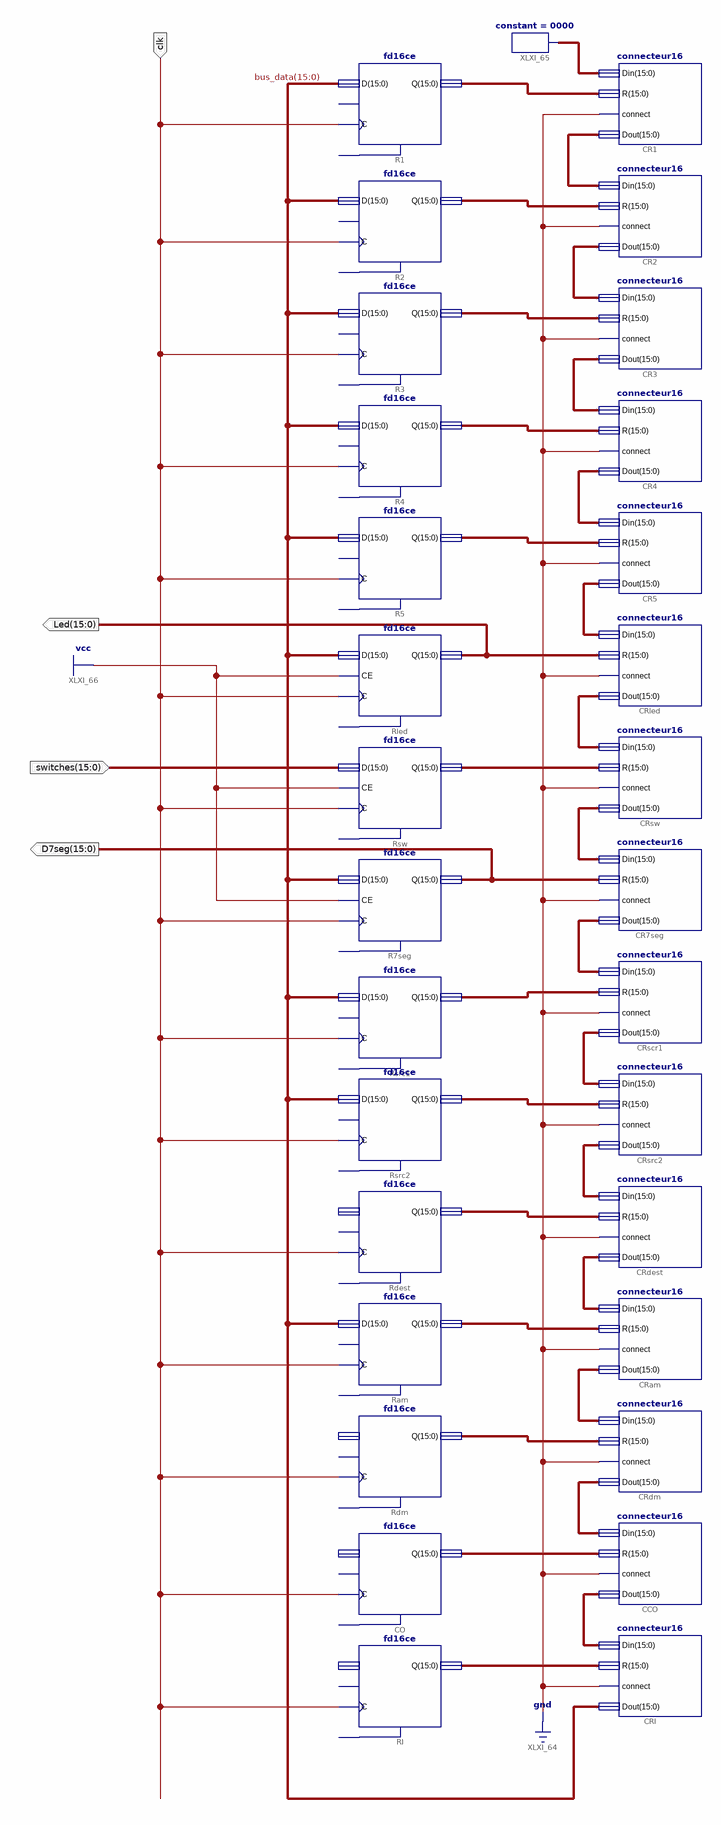
[diagram p0: schematic sheet 1]
// Xilinx ISE schematic S3.sch (spartan3e) as structural Verilog: 31 symbols, 4 ports
module S3 (
  input  clk,
  input  [15:0] switches,
  output [15:0] Led,
  output [15:0] D7seg
);

  wire [15:0] bus_data, XLXN_3, XLXN_4, XLXN_5, XLXN_6, XLXN_7, XLXN_9, XLXN_11, XLXN_12, XLXN_13, XLXN_14,
       XLXN_15, XLXN_16, XLXN_17, XLXN_18, XLXN_22, XLXN_24, XLXN_26, XLXN_28, XLXN_30, XLXN_32, XLXN_34,
       XLXN_36, XLXN_38, XLXN_40, XLXN_42, XLXN_44, XLXN_46, XLXN_55;

  fd16ce R7seg (.C(clk), .CE(1'b1), .D(bus_data), .Q(D7seg));  // open: CLR
  fd16ce Rsw (.C(clk), .CE(1'b1), .D(switches), .Q(XLXN_9));  // open: CLR
  fd16ce Rled (.C(clk), .CE(1'b1), .D(bus_data), .Q(Led));  // open: CLR
  fd16ce R5 (.C(clk), .D(bus_data), .Q(XLXN_7));  // open: CE, CLR
  fd16ce R4 (.C(clk), .D(bus_data), .Q(XLXN_6));  // open: CE, CLR
  fd16ce R3 (.C(clk), .D(bus_data), .Q(XLXN_5));  // open: CE, CLR
  fd16ce Rsrc1 (.C(clk), .D(bus_data), .Q(XLXN_11));  // open: CE, CLR
  fd16ce Rdest (.C(clk), .Q(XLXN_13));  // open: CE, CLR, D
  fd16ce Rdm (.C(clk), .Q(XLXN_15));  // open: CE, CLR, D
  fd16ce CO (.C(clk), .Q(XLXN_16));  // open: CE, CLR, D
  fd16ce Rsrc2 (.C(clk), .D(bus_data), .Q(XLXN_12));  // open: CE, CLR
  fd16ce Ram (.C(clk), .D(bus_data), .Q(XLXN_14));  // open: CE, CLR
  fd16ce RI (.C(clk), .Q(XLXN_17));  // open: CE, CLR, D
  fd16ce R2 (.C(clk), .D(bus_data), .Q(XLXN_4));  // open: CE, CLR
  fd16ce R1 (.C(clk), .D(bus_data), .Q(XLXN_3));  // open: CE, CLR
  connecteur16 CR1 (.Din(XLXN_55), .R(XLXN_3), .connect(1'b0), .Dout(XLXN_18));
  connecteur16 CR2 (.Din(XLXN_18), .R(XLXN_4), .connect(1'b0), .Dout(XLXN_22));
  connecteur16 CR3 (.Din(XLXN_22), .R(XLXN_5), .connect(1'b0), .Dout(XLXN_24));
  connecteur16 CR4 (.Din(XLXN_24), .R(XLXN_6), .connect(1'b0), .Dout(XLXN_26));
  connecteur16 CR5 (.Din(XLXN_26), .R(XLXN_7), .connect(1'b0), .Dout(XLXN_28));
  connecteur16 CRled (.Din(XLXN_28), .R(Led), .connect(1'b0), .Dout(XLXN_30));
  connecteur16 CRsw (.Din(XLXN_30), .R(XLXN_9), .connect(1'b0), .Dout(XLXN_32));
  connecteur16 CR7seg (.Din(XLXN_32), .R(D7seg), .connect(1'b0), .Dout(XLXN_34));
  connecteur16 CRscr1 (.Din(XLXN_34), .R(XLXN_11), .connect(1'b0), .Dout(XLXN_36));
  connecteur16 CRsrc2 (.Din(XLXN_36), .R(XLXN_12), .connect(1'b0), .Dout(XLXN_38));
  connecteur16 CRdest (.Din(XLXN_38), .R(XLXN_13), .connect(1'b0), .Dout(XLXN_40));
  connecteur16 CRam (.Din(XLXN_40), .R(XLXN_14), .connect(1'b0), .Dout(XLXN_42));
  connecteur16 CRdm (.Din(XLXN_42), .R(XLXN_15), .connect(1'b0), .Dout(XLXN_44));
  connecteur16 CCO (.Din(XLXN_44), .R(XLXN_16), .connect(1'b0), .Dout(XLXN_46));
  connecteur16 CRI (.Din(XLXN_46), .R(XLXN_17), .connect(1'b0), .Dout(bus_data));
  constant #(.CValue("0000")) XLXI_65 (.O(XLXN_55));
endmodule
